# Altium schematic sheet top_level_sheet.SchDoc
size A4; Author: Luis Henrique DAvila Possatti; Organization: University of Campinas
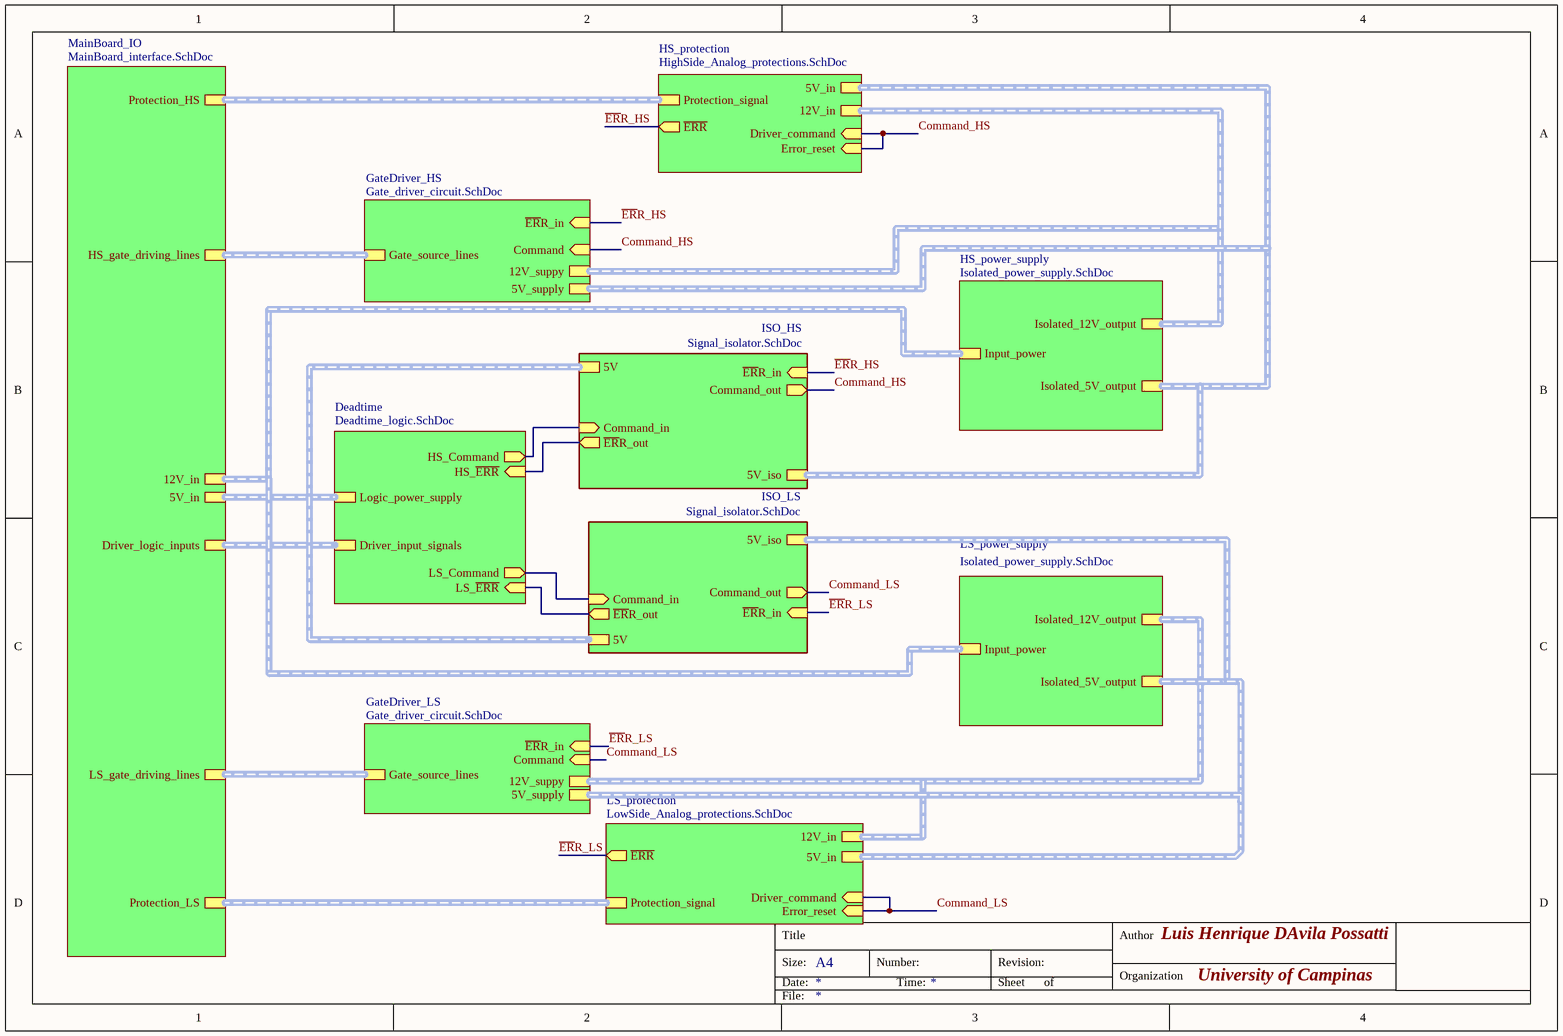
[diagram p0: top_level_sheet.SchDoc]

## Sub-sheets
Deadtime = Deadtime_logic.SchDoc: LS_~{ERR} (in), LS_Command (out), Driver_input_signals (harness Driver_logic_inputs), Logic_power_supply (harness 5V_rail), HS_Command (out), HS_~{ERR} (in)
GateDriver_HS = Gate_driver_circuit.SchDoc: Gate_source_lines (harness Driving_lines), Command (in), ~{ER}R_in (in), 12V_suppy (harness 12V_iso_rail), 5V_supply (harness 5V_iso_rail)
GateDriver_LS = Gate_driver_circuit.SchDoc: Gate_source_lines (harness Driving_lines), Command (in), ~{ER}R_in (in), 12V_suppy (harness 12V_iso_rail), 5V_supply (harness 5V_iso_rail)
HS_power_supply = Isolated_power_supply.SchDoc: Isolated_5V_output (harness 5V_iso_rail), Input_power (harness 12V_rail), Isolated_12V_output (harness 12V_iso_rail)
HS_protection = HighSide_Analog_protections.SchDoc: Protection_signal (harness Sensing_signals), Driver_command (in), Error_reset (in), 12V_in (harness 12V_iso_rail), 5V_in (harness 5V_iso_rail), ~{ERR} (out)
ISO_HS = Signal_isolator.SchDoc: ~{ER}R_out (out), Command_in (in), ~{ER}R_in (in), Command_out (out), 5V (harness 5V_rail), 5V_iso (harness 5V_iso_rail)
ISO_LS = Signal_isolator.SchDoc: ~{ER}R_out (out), Command_in (in), ~{ER}R_in (in), Command_out (out), 5V (harness 5V_rail), 5V_iso (harness 5V_iso_rail)
LS_power_supply = Isolated_power_supply.SchDoc: Isolated_5V_output (harness 5V_iso_rail), Input_power (harness 12V_rail), Isolated_12V_output (harness 12V_iso_rail)
LS_protection = LowSide_Analog_protections.SchDoc: Protection_signal (harness Sensing_signals), Driver_command (in), Error_reset (in), 12V_in (harness 12V_iso_rail), 5V_in (harness 5V_iso_rail), ~{ERR} (out)
MainBoard_IO = MainBoard_interface.SchDoc: 12V_in (harness 12V_rail), Driver_logic_inputs (harness Driver_logic_inputs), HS_gate_driving_lines (harness Driving_lines), LS_gate_driving_lines (harness Driving_lines), 5V_in (harness 5V_rail), Protection_LS (harness Sensing_signals), Protection_HS (harness Sensing_signals)

## Nets
~{ER}R_HS: sheet HS_protection/~{ERR}, sheet ISO_HS/~{ER}R_in, sheet GateDriver_HS/~{ER}R_in
~{ER}R_LS: sheet ISO_LS/~{ER}R_in, sheet GateDriver_LS/~{ER}R_in, sheet LS_protection/~{ERR}
Command_HS: sheet HS_protection/Driver_command, sheet HS_protection/Error_reset, sheet ISO_HS/Command_out, sheet GateDriver_HS/Command
Command_LS: sheet ISO_LS/Command_out, sheet GateDriver_LS/Command, sheet LS_protection/Driver_command, sheet LS_protection/Error_reset
(unnamed): sheet Deadtime/LS_~{ERR}, sheet ISO_LS/~{ER}R_out
(unnamed): sheet Deadtime/LS_Command, sheet ISO_LS/Command_in
(unnamed): sheet Deadtime/HS_Command, sheet ISO_HS/Command_in
(unnamed): sheet Deadtime/HS_~{ERR}, sheet ISO_HS/~{ER}R_out

## Buses and harness runs
harness sheet Deadtime/Driver_input_signals = sheet MainBoard_IO/Driver_logic_inputs
harness sheet Deadtime/Logic_power_supply = sheet ISO_HS/5V = sheet ISO_LS/5V = sheet MainBoard_IO/5V_in
harness sheet GateDriver_HS/5V_supply = sheet HS_power_supply/Isolated_5V_output = sheet HS_protection/5V_in = sheet ISO_HS/5V_iso
harness sheet GateDriver_HS/12V_suppy = sheet HS_power_supply/Isolated_12V_output = sheet HS_protection/12V_in
harness sheet GateDriver_HS/Gate_source_lines = sheet MainBoard_IO/HS_gate_driving_lines
harness sheet GateDriver_LS/5V_supply = sheet ISO_LS/5V_iso = sheet LS_power_supply/Isolated_5V_output = sheet LS_protection/5V_in
harness sheet GateDriver_LS/12V_suppy = sheet LS_power_supply/Isolated_12V_output = sheet LS_protection/12V_in
harness sheet GateDriver_LS/Gate_source_lines = sheet MainBoard_IO/LS_gate_driving_lines
harness sheet HS_power_supply/Input_power = sheet LS_power_supply/Input_power = sheet MainBoard_IO/12V_in
harness sheet HS_protection/Protection_signal = sheet MainBoard_IO/Protection_HS
harness sheet LS_protection/Protection_signal = sheet MainBoard_IO/Protection_LS

## Notes on the sheet
- Title
- Size:
- Date:
- A4
- Number:
- Time:
- Revision:
- Sheet
- of
- Author
- Organization
- File: